# Altium project UL-SWAP-DAQ-2-MAIN.PrjPcb
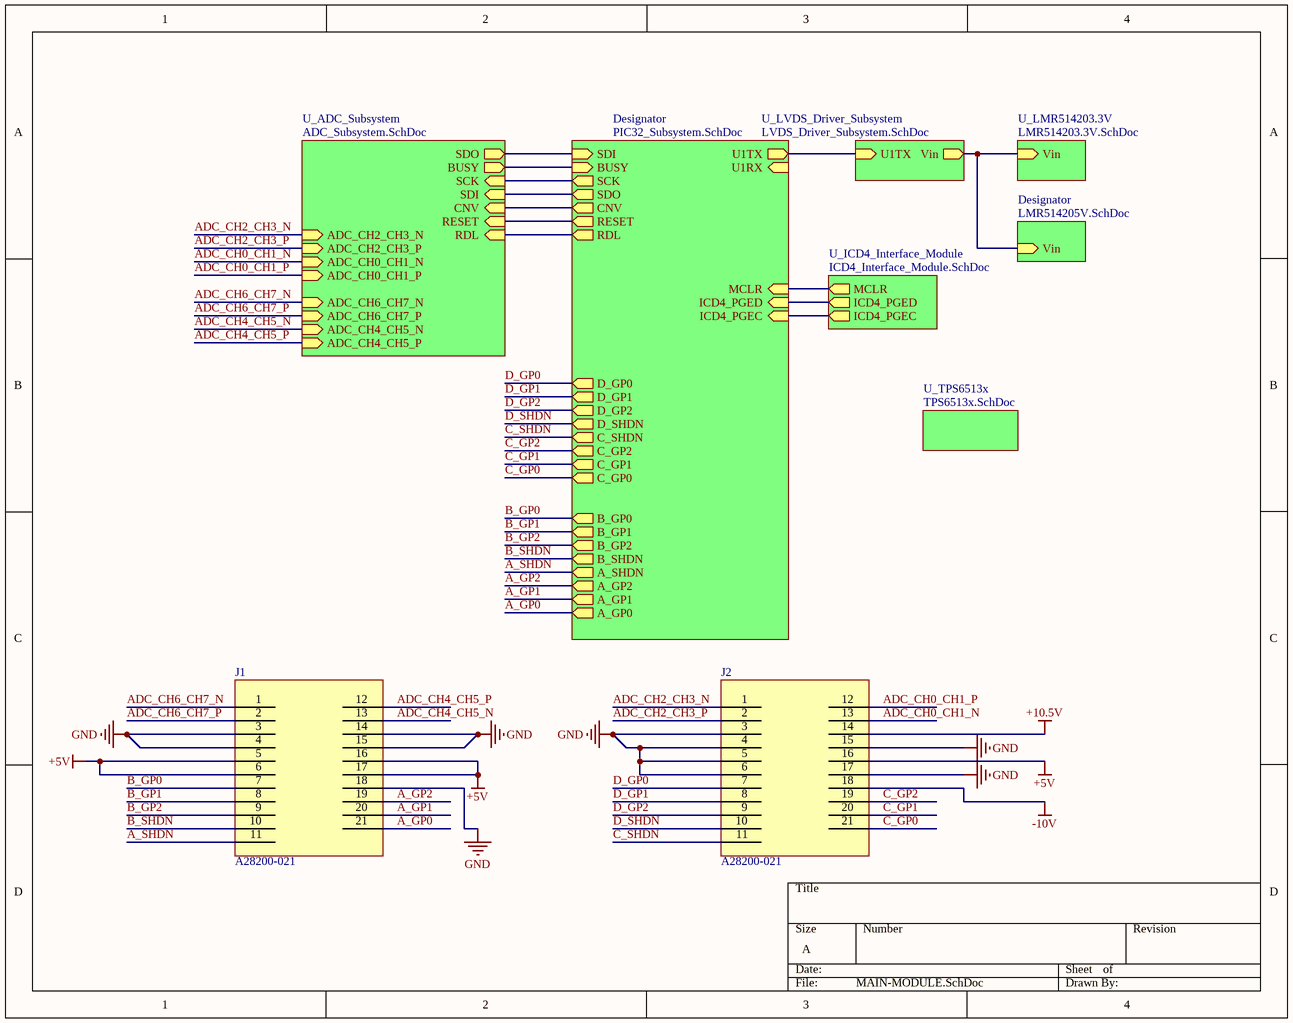
[diagram p0: MAIN-MODULE.SchDoc]
8 sheets, 70 parts. Net scope: hierarchical (ports join the sheet entries above them; power ports are global).
Board file: UL-SWAP-DAQ-3-MAIN.PcbDoc
Sheets:
  MAIN-MODULE.SchDoc
    Designator = PIC32_Subsystem.SchDoc
    U_ADC_Subsystem = ADC_Subsystem.SchDoc
    U_ICD4_Interface_Module = ICD4_Interface_Module.SchDoc
    U_LMR514203.3V = LMR514203.3V.SchDoc
    U_LVDS_Driver_Subsystem = LVDS_Driver_Subsystem.SchDoc
    Designator = LMR514205V.SchDoc
    U_TPS6513x = TPS6513x.SchDoc

## Sheet MAIN-MODULE.SchDoc
size A; SheetNumber: 1; SheetTotal: 8

### Parts
J1  A28200-021  [A28200-021]
J2  A28200-021  [A28200-021]

### Sub-sheets
Designator = PIC32_Subsystem.SchDoc: ICD4_PGED (in), ICD4_PGEC (in), MCLR (in), SCK (out), U1RX (in), SDO (out), RESET (out), SDI (in), U1TX (out), BUSY (in), CNV (out), RDL (out), C_GP1 (out), C_GP2 (out), C_GP0 (out), C_SHDN (out), A_GP2 (out), A_GP0 (out), A_GP1 (out), A_SHDN (out), D_SHDN (out), D_GP0 (out), D_GP1 (out), D_GP2 (out), B_GP0 (out), B_GP1 (out), B_GP2 (out), B_SHDN (out)
Designator = LMR514205V.SchDoc: Vin (in)
U_ADC_Subsystem = ADC_Subsystem.SchDoc: SDO (out), SCK (in), SDI (in), BUSY (out), CNV (in), RESET (in), RDL (in), ADC_CH6_CH7_P (in), ADC_CH6_CH7_N (in), ADC_CH4_CH5_P (in), ADC_CH4_CH5_N (in), ADC_CH2_CH3_N (in), ADC_CH2_CH3_P (in), ADC_CH0_CH1_N (in), ADC_CH0_CH1_P (in)
U_ICD4_Interface_Module = ICD4_Interface_Module.SchDoc: MCLR (out), ICD4_PGED (out), ICD4_PGEC (out)
U_LMR514203.3V = LMR514203.3V.SchDoc: Vin (in)
U_LVDS_Driver_Subsystem = LVDS_Driver_Subsystem.SchDoc: U1TX (in), Vin (out)
U_TPS6513x = TPS6513x.SchDoc: no entries

### Nets
+5V: J1.5 J1.6 J1.16 J1.17 J2.16
+10.5V: J2.14
-10V: J2.18
GND: J1.3 J1.4 J1.14 J1.15 J1.18 J2.3 J2.4 J2.5 J2.6 J2.15 J2.17
A_GP0: J1.21 ; sheet Designator/A_GP0
A_GP1: J1.20 ; sheet Designator/A_GP1
A_GP2: J1.19 ; sheet Designator/A_GP2
A_SHDN: J1.11 ; sheet Designator/A_SHDN
ADC_CH0_CH1_N: J2.13 ; sheet U_ADC_Subsystem/ADC_CH0_CH1_N
ADC_CH0_CH1_P: J2.12 ; sheet U_ADC_Subsystem/ADC_CH0_CH1_P
ADC_CH2_CH3_N: J2.1 ; sheet U_ADC_Subsystem/ADC_CH2_CH3_N
ADC_CH2_CH3_P: J2.2 ; sheet U_ADC_Subsystem/ADC_CH2_CH3_P
ADC_CH4_CH5_N: J1.13 ; sheet U_ADC_Subsystem/ADC_CH4_CH5_N
ADC_CH4_CH5_P: J1.12 ; sheet U_ADC_Subsystem/ADC_CH4_CH5_P
ADC_CH6_CH7_N: J1.1 ; sheet U_ADC_Subsystem/ADC_CH6_CH7_N
ADC_CH6_CH7_P: J1.2 ; sheet U_ADC_Subsystem/ADC_CH6_CH7_P
B_GP0: J1.7 ; sheet Designator/B_GP0
B_GP1: J1.8 ; sheet Designator/B_GP1
B_GP2: J1.9 ; sheet Designator/B_GP2
B_SHDN: J1.10 ; sheet Designator/B_SHDN
BUSY: sheet Designator/BUSY, sheet U_ADC_Subsystem/BUSY
C_GP0: J2.21 ; sheet Designator/C_GP0
C_GP1: J2.20 ; sheet Designator/C_GP1
C_GP2: J2.19 ; sheet Designator/C_GP2
C_SHDN: J2.11 ; sheet Designator/C_SHDN
CNV: sheet Designator/CNV, sheet U_ADC_Subsystem/CNV
D_GP0: J2.7 ; sheet Designator/D_GP0
D_GP1: J2.8 ; sheet Designator/D_GP1
D_GP2: J2.9 ; sheet Designator/D_GP2
D_SHDN: J2.10 ; sheet Designator/D_SHDN
MCLR: sheet Designator/MCLR, sheet U_ICD4_Interface_Module/MCLR
PGC: sheet Designator/ICD4_PGEC, sheet U_ICD4_Interface_Module/ICD4_PGEC
PGD: sheet Designator/ICD4_PGED, sheet U_ICD4_Interface_Module/ICD4_PGED
RDL: sheet Designator/RDL, sheet U_ADC_Subsystem/RDL
RESET: sheet Designator/RESET, sheet U_ADC_Subsystem/RESET
UART_TX: sheet Designator/U1TX, sheet U_LVDS_Driver_Subsystem/U1TX
Vin: sheet U_LMR514203.3V/Vin, sheet U_LVDS_Driver_Subsystem/Vin, sheet Designator/Vin
NetU1_47: sheet Designator/SDI, sheet U_ADC_Subsystem/SDO
NetU1_50: sheet Designator/SCK, sheet U_ADC_Subsystem/SCK
NetU1_51: sheet Designator/SDO, sheet U_ADC_Subsystem/SDI

### Library data of the parts
J1 J2 = A28200-021: CONN NANO-D PLUG 21POS SMD SLDR

## Sheet PIC32_Subsystem.SchDoc
size A; SheetNumber: 6; SheetTotal: 7
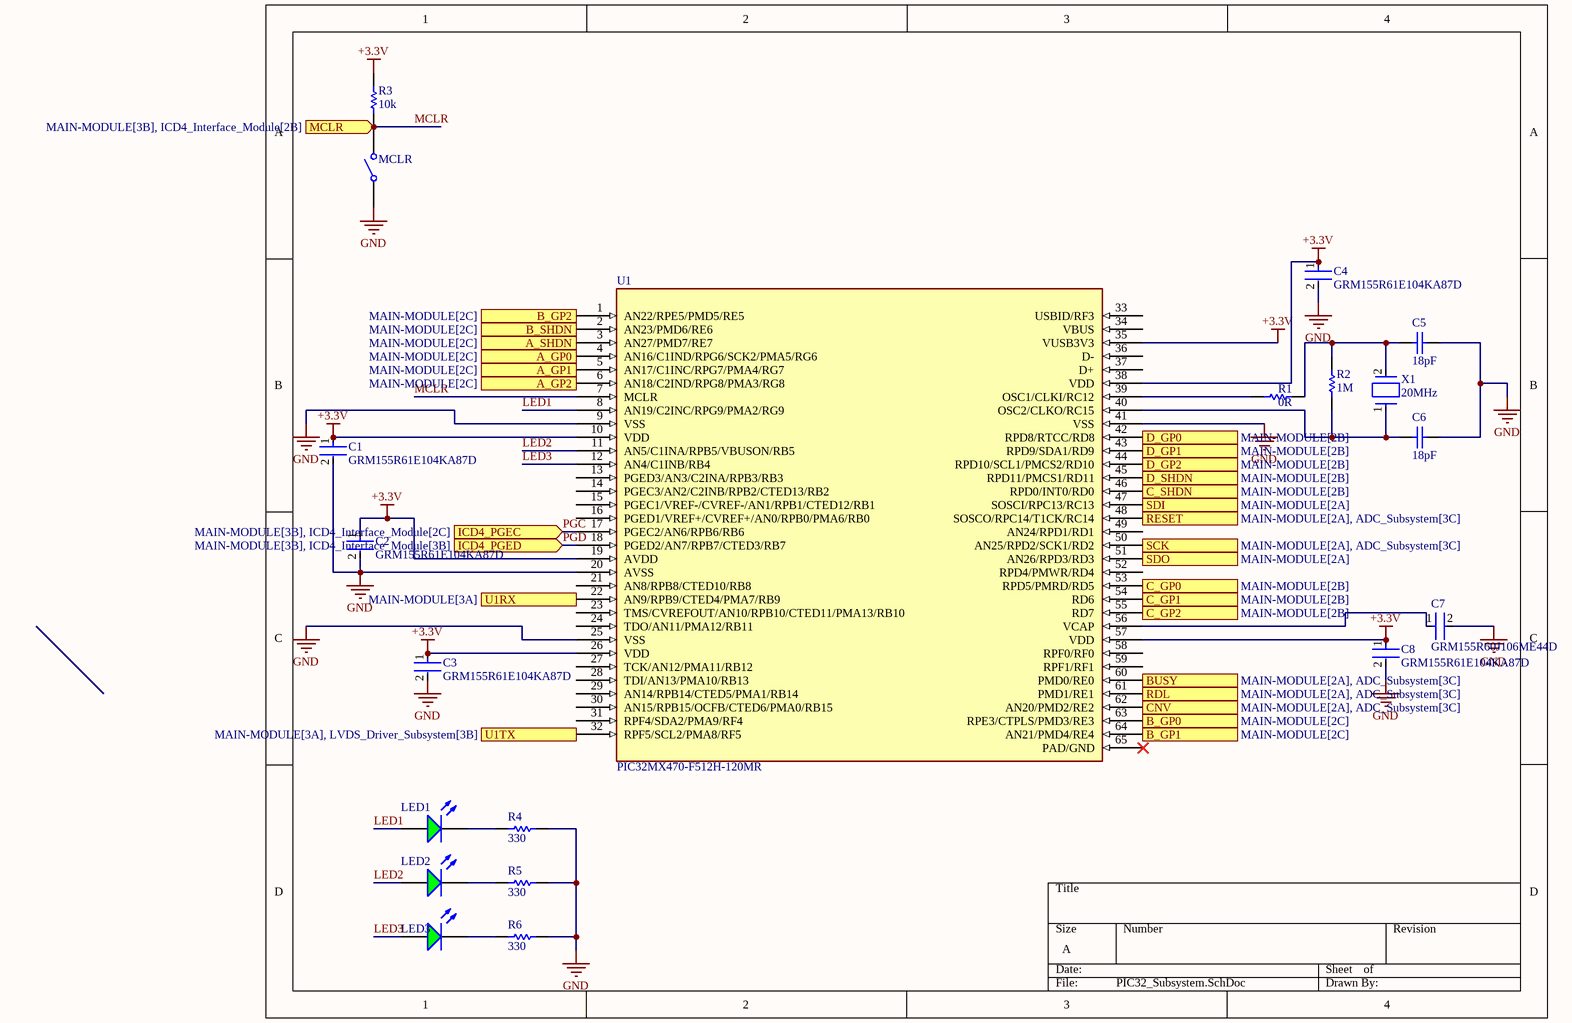
[diagram p1: PIC32_Subsystem.SchDoc]

### Parts
C1  GRM155R61E104KA87D  [FP-GRM155-0_05-IPC_A]
C2  GRM155R61E104KA87D  [FP-GRM155-0_05-IPC_A]
C3  GRM155R61E104KA87D  [FP-GRM155-0_05-IPC_A]
C4  GRM155R61E104KA87D  [FP-GRM155-0_05-IPC_A]
C5  18pF  [CAPC1005X55X25LL05T10]
C6  18pF  [CAPC1005X55X25LL05T10]
C7  GRM155R60J106ME44D  [FP-GRM155-0_2-IPC_A]
C8  GRM155R61E104KA87D  [FP-GRM155-0_05-IPC_A]
LED1  (no value)  [KING-APT1608SGC_V]
LED2  (no value)  [KING-APT1608SGC_V]
LED3  (no value)  [KING-APT1608SGC_V]
MCLR  434121043816  [434121043816]  (value not drawn)
R1  0R  [RESC1005X40X25LL05T10]
R2  1M  [RESC1005X40X25LL05T05]
R3  10k  [RESC1005X40X25LL05T05]
R4  330  [RESC1609X50X30LL10T20]
R5  330  [RESC1609X50X30LL10T20]
R6  330  [RESC1609X50X30LL10T20]
U1  PIC32MX470-F512H-120MR  [TQFP]
X1  20MHz  [FP-ABM7-MFG]

### Ports
A_GP0 (out, see MAIN-MODULE[2C]), A_GP1 (out, see MAIN-MODULE[2C]), A_GP2 (out, see MAIN-MODULE[2C]), A_SHDN (out, see MAIN-MODULE[2C]), B_GP0 (out, see MAIN-MODULE[2C]), B_GP1 (out, see MAIN-MODULE[2C]), B_GP2 (out, see MAIN-MODULE[2C]), B_SHDN (out, see MAIN-MODULE[2C]), BUSY (in, see MAIN-MODULE[2A], ADC_Subsystem[3C]), C_GP0 (out, see MAIN-MODULE[2B]), C_GP1 (out, see MAIN-MODULE[2B]), C_GP2 (out, see MAIN-MODULE[2B]), C_SHDN (out, see MAIN-MODULE[2B]), CNV (out, see MAIN-MODULE[2A], ADC_Subsystem[3C]), D_GP0 (out, see MAIN-MODULE[2B]), D_GP1 (out, see MAIN-MODULE[2B]), D_GP2 (out, see MAIN-MODULE[2B]), D_SHDN (out, see MAIN-MODULE[2B]), ICD4_PGEC (in, see MAIN-MODULE[3B], ICD4_Interface_Module[2C]), ICD4_PGED (in, see MAIN-MODULE[3B], ICD4_Interface_Module[3B]), MCLR (in, see MAIN-MODULE[3B], ICD4_Interface_Module[2B]), RDL (out, see MAIN-MODULE[2A], ADC_Subsystem[3C]), RESET (out, see MAIN-MODULE[2A], ADC_Subsystem[3C]), SCK (out, see MAIN-MODULE[2A], ADC_Subsystem[3C]), SDI (in, see MAIN-MODULE[2A]), SDO (out, see MAIN-MODULE[2A]), U1RX (in, see MAIN-MODULE[3A]), U1TX (out, see MAIN-MODULE[3A], LVDS_Driver_Subsystem[3B])

### Nets
+3.3V: C1.1 C2.1 C3.1 C4.1 C8.1 R3.2 U1.10(VDD) U1.19(AVDD) U1.26(VDD) U1.35(VUSB3V3) U1.38(VDD) U1.57(VDD)
GND: C1.2 C2.2 C3.2 C4.2 C5.2 C6.2 C7.2 C8.2 MCLR.1 R4.2 R5.2 R6.2 U1.9(VSS) U1.20(AVSS) U1.25(VSS) U1.41(VSS)
A_GP0: U1.4(AN16/C1IND/RPG6/SCK2/PMA5/RG6) ; port A_GP0
A_GP1: U1.5(AN17/C1INC/RPG7/PMA4/RG7) ; port A_GP1
A_GP2: U1.6(AN18/C2IND/RPG8/PMA3/RG8) ; port A_GP2
A_SHDN: U1.3(AN27/PMD7/RE7) ; port A_SHDN
B_GP0: U1.63(RPE3/CTPLS/PMD3/RE3) ; port B_GP0
B_GP1: U1.64(AN21/PMD4/RE4) ; port B_GP1
B_GP2: U1.1(AN22/RPE5/PMD5/RE5) ; port B_GP2
B_SHDN: U1.2(AN23/PMD6/RE6) ; port B_SHDN
BUSY: U1.60(PMD0/RE0) ; port BUSY
C_GP0: U1.53(RPD5/PMRD/RD5) ; port C_GP0
C_GP1: U1.54(RD6) ; port C_GP1
C_GP2: U1.55(RD7) ; port C_GP2
C_SHDN: U1.46(RPD0/INT0/RD0) ; port C_SHDN
CNV: U1.62(AN20/PMD2/RE2) ; port CNV
D_GP0: U1.42(RPD8/RTCC/RD8) ; port D_GP0
D_GP1: U1.43(RPD9/SDA1/RD9) ; port D_GP1
D_GP2: U1.44(RPD10/SCL1/PMCS2/RD10) ; port D_GP2
D_SHDN: U1.45(RPD11/PMCS1/RD11) ; port D_SHDN
LED1: LED1.1(A) U1.8(AN19/C2INC/RPG9/PMA2/RG9)
LED2: LED2.1(A) U1.11(AN5/C1INA/RPB5/VBUSON/RB5)
LED3: LED3.1(A) U1.12(AN4/C1INB/RB4)
MCLR: MCLR.2 R3.1 U1.7(MCLR) ; port MCLR
PGC: U1.17(PGEC2/AN6/RPB6/RB6) ; port ICD4_PGEC
PGD: U1.18(PGED2/AN7/RPB7/CTED3/RB7) ; port ICD4_PGED
RDL: U1.61(PMD1/RE1) ; port RDL
RESET: U1.48(SOSCO/RPC14/T1CK/RC14) ; port RESET
UART_TX: U1.32(RPF5/SCL2/PMA8/RF5) ; port U1TX
NetC5_1: C5.1 R1.2 R2.2 X1.2
NetC6_1: C6.1 R2.1 U1.40(OSC2/CLKO/RC15) X1.1
NetC7_1: C7.1 U1.56(VCAP)
NetLED1_2: LED1.2(K) R4.1
NetLED2_2: LED2.2(K) R5.1
NetLED3_2: LED3.2(K) R6.1
NetR1_1: R1.1 U1.39(OSC1/CLKI/RC12)
NetU1_22: U1.22(AN9/RPB9/CTED4/PMA7/RB9) ; port U1RX
NetU1_47: U1.47(SOSCI/RPC13/RC13) ; port SDI
NetU1_50: U1.50(AN25/RPD2/SCK1/RD2) ; port SCK
NetU1_51: U1.51(AN26/RPD3/RD3) ; port SDO

Not connected (* = marked no-connect by the designer): U1 13(PGED3/AN3/C2INA/RPB3/RB3) 14(PGEC3/AN2/C2INB/RPB2/CTED13/RB2) 15(PGEC1/VREF-/CVREF-/AN1/RPB1/CTED12/RB1) 16(PGED1/VREF+/CVREF+/AN0/RPB0/PMA6/RB0) 21(AN8/RPB8/CTED10/RB8) 23(TMS/CVREFOUT/AN10/RPB10/CTED11/PMA13/RB10) 24(TDO/AN11/PMA12/RB11) 27(TCK/AN12/PMA11/RB12) 28(TDI/AN13/PMA10/RB13) 29(AN14/RPB14/CTED5/PMA1/RB14) 30(AN15/RPB15/OCFB/CTED6/PMA0/RB15) 31(RPF4/SDA2/PMA9/RF4) 33(USBID/RF3) 34(VBUS) 36(D-) 37(D+) 49(AN24/RPD1/RD1) 52(RPD4/PMWR/RD4) 58(RPF0/RF0) 59(RPF1/RF1) 65(PAD/GND)*

### Library data of the parts
C1-C4 C8 = CMP-2008-04580-2: CAP CER 0.1UF 25V X5R 0402; Lead/Base Style: Bayonet; Capacitance: 100nF; Tolerance: 10%; Material: Ceramic; REACH SVHC: No SVHC; Voltage: 25V; Voltage Rating: 25V; Length: 1mm; Min Operating Temperature: -55°C; Case/Package: 0402; Width: 0.5mm; Termination: Standard; Series: GRM; Mount: Surface Mount; Thickness: 0.022inch; Lead Free: Lead Free; Voltage Rating (DC): 25V; Package Quantity: 10000; Weight: 0.000388oz; Height: 0.5mm; Case Code (Metric): 1005; RoHS Compliant: Yes; Packaging: Cut Tape; Depth: 0.5mm; Case Code (Imperial): 0402; Radiation Hardening: No; Max Operating Temperature: 85°C; Dielectric: X5R
C5 C6 = CMP-2008-04271-1: GRM1555C1H180GA01D; Manufacturer: Murata; Part Number: GRM1555C1H180GA01D
C7 = CMP-2000-05265-2: CAP CER 10UF 6.3V X5R 0402; Tolerance: 20%; Voltage Rating: 6.3V; Voltage Rating (DC): 6.3V; Voltage: 6.3V; Case Code (Metric): 1005; REACH SVHC: No SVHC; Min Operating Temperature: -55°C; Height: 0.5mm; Dielectric: X5R; Depth: 0.5mm; Thickness: 0.022inch; Packaging: Tape and Reel; Length: 1mm; Mount: Surface Mount; Package Quantity: 10000; Lead Free: Lead Free; Case/Package: 0402; Termination: SMD/SMT; Max Operating Temperature: 85°C; Case Code (Imperial): 0402; Series: GRM; Capacitance: 10uF; Width: 0.5mm; RoHS Compliant: Yes
LED1-LED3 = CMP-2000-05789-1: Super Bright Green LED, 62.5 mW, 25 mA, -40 to 85 degC, 2-Pin SMD, RoHS, Tape and Reel, APT1608SGC; Manufacturer: Kingbright; Online Catalog: 0603RectanglewithFlatTopChipLEDs; Wavelength - Dominant: 568nm; Wavelength - Peak: 565nm; Voltage - Forward (Vf) (Typ): 2.2V; Lens Type: Clear; Other Names: 754-1121-2; Millicandela Rating: 15mcd; Catalog Drawings: APT1608SeriesTop / APT1608SeriesSide; Lens Style/Size: RectanglewithFlatTop,1.2mmx0.8mm; Current - Test: 20mA; 3D Model: APT1608x.sldprt / APT1608x.pro / APT1608x.igs / APT1608x.stp; Viewing Angle: 120°; Package / Case: 0603(1608Metric); Category: Optoelectronics; Package Description: 2-Pin Surface Mount Device, Body 0.8 x 1.6 mm; Mounting Type: SurfaceMount; Color: Green; Height: 0.75mm; Datasheet Version: Rev. 16B, 02/2012; Family: LEDIndication-Discrete; Manufacturer URL: http://www.kingbright.com/; Package Reference: APT1608SGC; Datasheet URL: https://datasheet.ciiva.com/2113/apt1608sgc-2113808.pdf; Mounting Technology: SurfaceMount; Packaging: Tape&Reel(TR); Standard Package: 2,000; Size / Dimension: 1.60mmLx0.80mmW
MCLR = CMP-1459-00005-1: WS-TASV SMD Tact Switch 6.0X3.5 mm; Manufacturer: Wuerth Elektronik; NoPins: 02; ComponentLink1URL: http://www.we-online.com; PartNumber: 434121043816; ComponentLink2URL: http://katalog.we-online.de/em/datasheet/434121043816.pdf; ComponentLink2Description: Datasheet; ComponentLink1Description: Manufacturer URL; PackageReference: 434121043816
R1 = CMP-1011-00001-2: RC0402JR-070RL; Manufacturer: Yageo / Phycomp; Part Number: RC0402JR-070RL
R2 = CMP-2002-00609-3: Chip Resistor, 1 MOhm, +/- 1%, 100 mW, -55 to 155 degC, 0402 (1005 Metric), RoHS, Tape and Reel / ERJ-2RKF1004X; Manufacturer: Basic Passives; Voltage Rating: 50 V; Case\/Package: 0402; Resistance: 1 MOhm; Power Rating: 100 mW; Pins: 2; Max Operating Temperature: 155 degC; ComponentLink2URL: http://industrial.panasonic.com/cdbs/www-data/pdf/RDA0000/AOA0000C86.pdf; Weight: 2.8E-05oz; ComponentLink1URL: http://www.panasonic.com/; Radiation Hardening: No; Height: 0.35 mm; Case Code (Imperial): 0402; ComponentLink2Description: Datasheet; Mount: Surface Mount; ComponentLink1Description: Manufacturer URL; REACH SVHC: Yes; PartNumber: ERJ-2RKF1004X; Length: 1 mm; Min Operating Temperature: -55 degC; Width: 0.5 mm; Package Quantity: 10000; Tolerance: 1%; PackageDescription: 2-Pin Surface Mount Device, Body 1 x 0.5 mm; RoHSCompliant: true; DatasheetVersion: 04/2015; PackageReference: 0402; Mounting Technology: Surface Mount; Case Code (Metric): 1005; Packaging: Tape and Reel
R3 = CMP-2000-07588-1: Chip Resistor, 10 KOhm, +/- 1%, 0.1 W, -55 to 155 degC, 0402 (1005 Metric), RoHS, Tape and Reel / ERJ2RKF1002X; Manufacturer: Panasonic; Power Rating: 100mW; Voltage Rating: 50V; Resistance: 10KOhm; Case\/Package: 0402; Temperature Coefficient: 100ppm\/degreesC; RoHSCompliant: True; Lead Free: LeadFree; Package Quantity: 1; Contact Plating: Tin; Length: 1mm; Radiation Hardening: No; REACH SVHC: NoSVHC; Max Operating Temperature: 155degC; Depth: 0.5mm; Case Code (Imperial): 0402; Military Standard: Not; Package Description: 2-Pin Surface Mount Device, Body 1 x 0.5 mm; Termination: SMD/SMT; Case Code (Metric): 1005; Height: 0.35mm; Packaging: TapeandReel; Voltage Rating (DC): 50V; Package Reference: 402; Number of Pins: 2; Tolerance: 1%; Mounting Technology: SurfaceMount; Width: 0.02inch; Mount: SurfaceMount; Datasheet URL: https://industrial.panasonic.com/cdbs/www-data/pdf/RDA0000/AOA0000C304.pdf; Composition: ThickFilm; Datasheet Version: 02/2017; Manufacturer URL: http://www.panasonic.com/; Max Power Dissipation: 100mW; Number of Terminations: 2; Min Operating Temperature: -55degC
R4-R6 = CMP-1012-00062-2: CRCW0603330RJNEA; Manufacturer: Vishay Dale; Part Number: CRCW0603330RJNEA
X1 = CMP-27762-013587-1: Crystal 20MHz ±20ppm 18pF SMD-2 6mm x 3.5mm / ABM7-20.000MHZ-D2Y-T; Frequency Stability: 30ppm; ESR (Equivalent Series Resistance): 50R; Contact Plating: Gold; Load Capacitance: 18pF; Tolerance: 20ppm; Length: 6mm; Frequency: 20MHz; Lead Free: Lead Free; Package Quantity: 1000; Resistor Type: Ceramic; Min Operating Temperature: -40°C; Max Operating Temperature: 85°C; Series: ABM7; Depth: 3.5mm; Width: 0.138inch; Frequency Tolerance: 20ppm; Termination: SMD/SMT; Radiation Hardening: No; Case/Package: CSMD; Height: 0.055inch; Packaging: Tape and Reel; Operating Frequency: 20 MHz; Series Resistance: 50R; Number of Pins: 2; Mount: Surface Mount

## Sheet ADC_Subsystem.SchDoc
size A; SheetNumber: 2; SheetTotal: 7
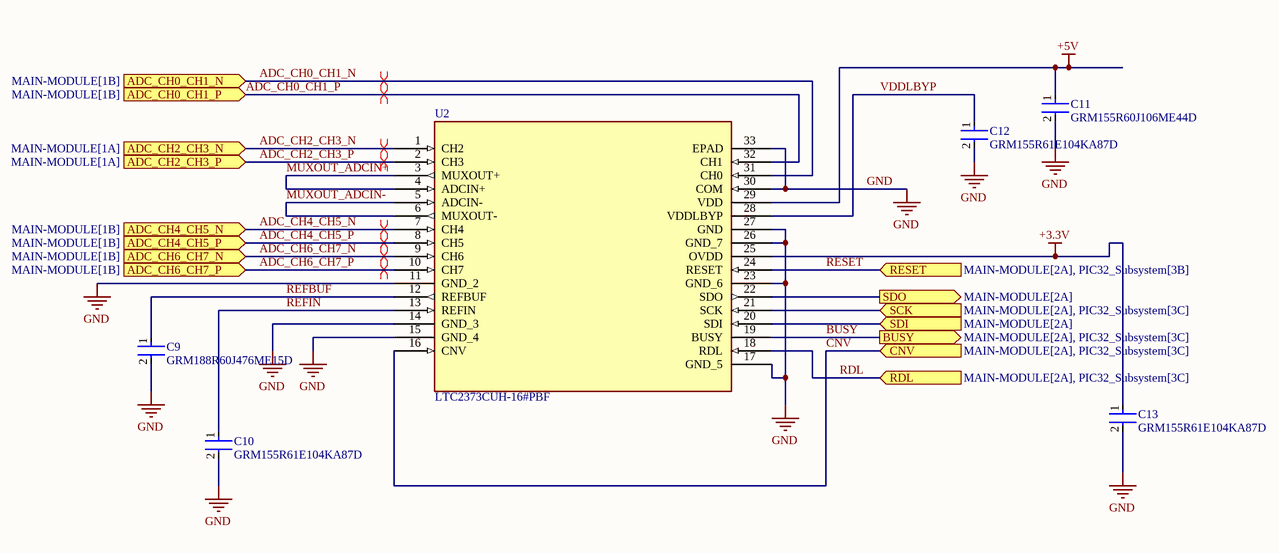
[diagram p2: ADC_Subsystem.SchDoc]

### Parts
C9  GRM188R60J476ME15D  [FP-GRM188-0_2-IPC_B]
C10  GRM155R61E104KA87D  [FP-GRM155-0_05-IPC_A]
C11  GRM155R60J106ME44D  [FP-GRM155-0_2-IPC_A]
C12  GRM155R61E104KA87D  [FP-GRM155-0_05-IPC_A]
C13  GRM155R61E104KA87D  [FP-GRM155-0_05-IPC_A]
U2  LTC2373CUH-16#PBF  [LTC_2373_Footprint]

### Ports
ADC_CH0_CH1_N (in, see MAIN-MODULE[1B]), ADC_CH0_CH1_P (in, see MAIN-MODULE[1B]), ADC_CH2_CH3_N (in, see MAIN-MODULE[1A]), ADC_CH2_CH3_P (in, see MAIN-MODULE[1A]), ADC_CH4_CH5_N (in, see MAIN-MODULE[1B]), ADC_CH4_CH5_P (in, see MAIN-MODULE[1B]), ADC_CH6_CH7_N (in, see MAIN-MODULE[1B]), ADC_CH6_CH7_P (in, see MAIN-MODULE[1B]), BUSY (out, see MAIN-MODULE[2A], PIC32_Subsystem[3C]), CNV (in, see MAIN-MODULE[2A], PIC32_Subsystem[3C]), RDL (in, see MAIN-MODULE[2A], PIC32_Subsystem[3C]), RESET (in, see MAIN-MODULE[2A], PIC32_Subsystem[3B]), SCK (in, see MAIN-MODULE[2A], PIC32_Subsystem[3C]), SDI (in, see MAIN-MODULE[2A]), SDO (out, see MAIN-MODULE[2A])

### Nets
+3.3V: C13.1 U2.25(OVDD)
+5V: C11.1 U2.29(VDD)
GND: C9.2 C10.2 C11.2 C12.2 C13.2 U2.11(GND_2) U2.14(GND_3) U2.15(GND_4) U2.17(GND_5) U2.23(GND_6) U2.26(GND_7) U2.27(GND) U2.30(COM) U2.33(EPAD)
ADC_CH0_CH1_N: U2.31(CH0) ; port ADC_CH0_CH1_N
ADC_CH0_CH1_P: U2.32(CH1) ; port ADC_CH0_CH1_P
ADC_CH2_CH3_N: U2.1(CH2) ; port ADC_CH2_CH3_N
ADC_CH2_CH3_P: U2.2(CH3) ; port ADC_CH2_CH3_P
ADC_CH4_CH5_N: U2.7(CH4) ; port ADC_CH4_CH5_N
ADC_CH4_CH5_P: U2.8(CH5) ; port ADC_CH4_CH5_P
ADC_CH6_CH7_N: U2.9(CH6) ; port ADC_CH6_CH7_N
ADC_CH6_CH7_P: U2.10(CH7) ; port ADC_CH6_CH7_P
BUSY: U2.19(BUSY) ; port BUSY
CNV: U2.16(CNV) ; port CNV
MUXOUT_ADCIN+: U2.3(MUXOUT+) U2.4(ADCIN+)
MUXOUT_ADCIN-: U2.5(ADCIN-) U2.6(MUXOUT-)
RDL: U2.18(RDL) ; port RDL
REFBUF: C9.1 U2.12(REFBUF)
REFIN: C10.1 U2.13(REFIN)
RESET: U2.24(RESET) ; port RESET
VDDLBYP: C12.1 U2.28(VDDLBYP)
NetU1_47: U2.22(SDO) ; port SDO
NetU1_50: U2.21(SCK) ; port SCK
NetU1_51: U2.20(SDI) ; port SDI

### Layout directives
differential pair: ADC_CH0_CH1_N, ADC_CH0_CH1_P, ADC_CH2_CH3_N, ADC_CH2_CH3_P, ADC_CH4_CH5_N, ADC_CH4_CH5_P, ADC_CH6_CH7_N, ADC_CH6_CH7_P

### Library data of the parts
C9 = CMP-2000-05444-2: Chip Multilayer Ceramic Capacitors for General Purpose, 0603, 47uF, X5R, 15%, 20%, 6.3V; Voltage Rating (DC): 6.3V; Thickness: 0.039inch; Case Code (Imperial): 0603; Packaging: Tape and Reel; Capacitance: 47uF; Width: 0.031inch; Dielectric: X5R; Max Operating Temperature: 85°C; Mount: Surface Mount; Case Code (Metric): 1608; Length: 0.063inch; Voltage Rating: 6.3V; Tolerance: 20%; Case/Package: 0603; Min Operating Temperature: -55°C
C10 C12 C13 = CMP-2008-04580-2: as C1 on sheet PIC32_Subsystem; REACH SVHC: No SVHC; Voltage: 25V; Voltage Rating: 25V; Length: 1mm; Min Operating Temperature: -55°C; Case/Package: 0402; Width: 0.5mm; Termination: Standard; Series: GRM; Mount: Surface Mount; Thickness: 0.022inch; Lead Free: Lead Free; Voltage Rating (DC): 25V; Package Quantity: 10000; Weight: 0.000388oz; Height: 0.5mm; Case Code (Metric): 1005; RoHS Compliant: Yes; Packaging: Cut Tape; Depth: 0.5mm; Case Code (Imperial): 0402; Radiation Hardening: No; Max Operating Temperature: 85°C; Dielectric: X5R
C11 = CMP-2000-05265-2: as C7 on sheet PIC32_Subsystem; Voltage Rating: 6.3V; Voltage Rating (DC): 6.3V; Voltage: 6.3V; Case Code (Metric): 1005; REACH SVHC: No SVHC; Min Operating Temperature: -55°C; Height: 0.5mm; Dielectric: X5R; Depth: 0.5mm; Thickness: 0.022inch; Packaging: Tape and Reel; Length: 1mm; Mount: Surface Mount; Package Quantity: 10000; Lead Free: Lead Free; Case/Package: 0402; Termination: SMD/SMT; Max Operating Temperature: 85°C; Case Code (Imperial): 0402; Series: GRM; Capacitance: 10uF; Width: 0.5mm; RoHS Compliant: Yes

## Sheet ICD4_Interface_Module.SchDoc
size A; SheetNumber: 3; SheetTotal: 7
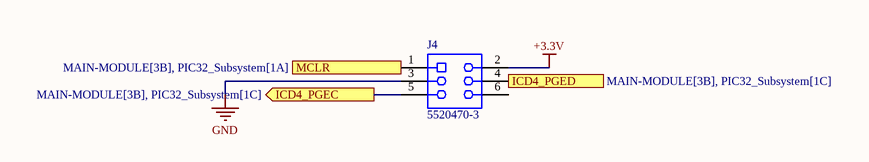
[diagram p3: ICD4_Interface_Module.SchDoc]

### Parts
J4  5520470-3  [TECO-5520470-3_V]

### Ports
ICD4_PGEC (out, see MAIN-MODULE[3B], PIC32_Subsystem[1C]), ICD4_PGED (out, see MAIN-MODULE[3B], PIC32_Subsystem[1C]), MCLR (out, see MAIN-MODULE[3B], PIC32_Subsystem[1A])

### Nets
+3.3V: J4.2
GND: J4.3
MCLR: J4.1 ; port MCLR
PGC: J4.5 ; port ICD4_PGEC
PGD: J4.4 ; port ICD4_PGED

Not connected (* = marked no-connect by the designer): J4 6

### Library data of the parts
J4 = CMP-1682-00001-5: Modular Jack, 6 Position, Right Angle, RoHS, Tray; Manufacturer: TE Connectivity; Voltage Rating: 150 V; Current Rating: 1.5 A; Lead Pitch: 2.54 mm; Contact Material: Bronze; RoHSCompliant: true; Contact Finish: Gold; REACH SVHC: Unknown; Height: 16.13 mm; Colour: Black; ComponentLink1Description: Manufacturer URL; PackageDescription: Female Header, Pitch 1.27 mm, 2 x 3 Position, Height 16.13 mm, Tail Length 4.32 mm; ComponentLink2URL: http://www.te.com/commerce/DocumentDelivery/DDEController?Action=srchrtrv&DocNm=5520470&DocType=Customer+Drawing&DocLang=English; ComponentLink2Description: Datasheet; Package Quantity: 176; Pins: 6; Length: 13.34 mm; Packaging: Tray; Contact Plating: Gold; Housing Material: PBT; Max Voltage Rating (AC): 150 V; ComponentLink1URL: http://www.te.com/; Mount: Through Hole; DatasheetVersion: Rev. B1, 03/2011; PackageReference: 5520470-3; Mounting Technology: Through Hole

## Sheet LMR514203.3V.SchDoc
size A; SheetNumber: 4; SheetTotal: 8
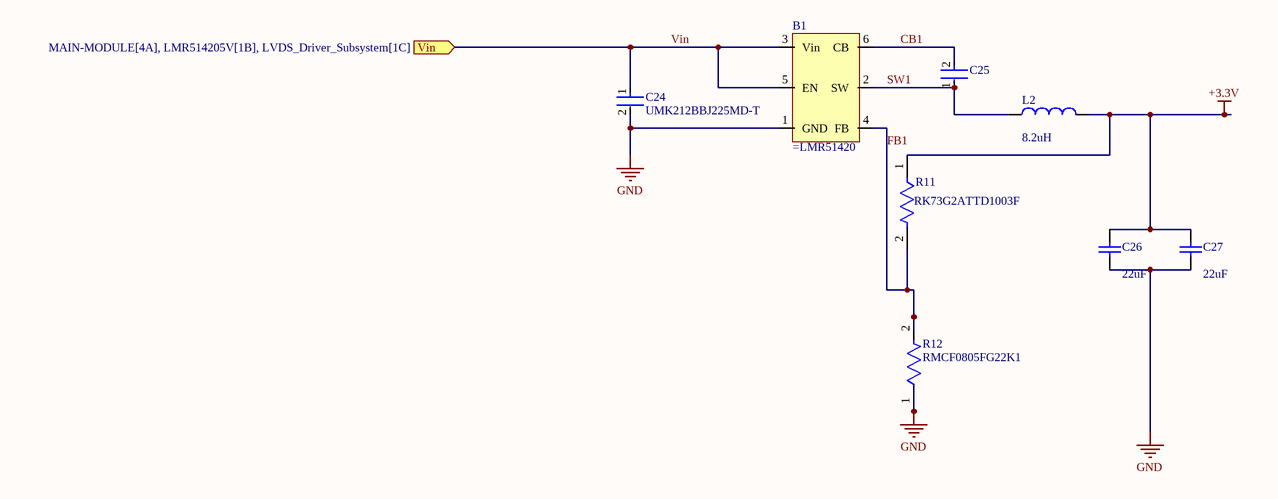
[diagram p4: LMR514203.3V.SchDoc]

### Parts
B1  (no value)  [LMR51420IC]
C24  UMK212BBJ225MD-T  [FP-0805-L_2_0_0_2-W_1_25-IPC_A]
C25  C0603C104K4PAC7867  [CAP CER 0.1UF 16V X7R 0603]  (value not drawn)
C26  value 22uF  [Cap22uF_C1206C226M4PAC7800]  (hidden comment: Comment)
C27  value 22uF  [Cap22uF_C1206C226M4PAC7800]  (hidden comment: Comment)
L2  value 8.2uH  [MSS1246H-103MED 10uH]  (hidden comment: MSS1260H-822MED)
R11  RK73G2ATTD1003F  [FP-RK73G2A-IPC_A]
R12  RMCF0805FG22K1  [FP-RMCF0805-IPC_B]

### Ports
Vin (in, see MAIN-MODULE[4A], LMR514205V[1B], LVDS_Driver_Subsystem[1C])

### Nets
+3.3V: C26.2 C27.2 L2.2 R11.1
GND: B1.1(GND) C24.2 C26.1 C27.1 R12.1
CB1: B1.6(CB) C25.2
FB1: B1.4(FB) R11.2 R12.2
SW1: B1.2(SW) C25.1 L2.1
Vin: B1.3(Vin) B1.5(EN) C24.1 ; port Vin

### Library data of the parts
B1 = Component_1
C24 = CMP-14477-004278-2: Multilayer Ceramic Capacitor 2.2uF 50V X5R 20% SMD 0803 T/R; Max Operating Temperature: 85°C; Tolerance: 20%; Case Code (Imperial): 0805; Case/Package: 0805; Case Code (Metric): 2012; Capacitance: 2.2uF; Min Operating Temperature: -55°C; Mount: Surface Mount; Voltage Rating: 50V; Packaging: Tape and Reel; RoHS Compliant: Yes
C25 = b4654b650e69147ec39a6b967a45e02: CAP CER 0.1UF 16V X5R 0603; Manufacturer: KEMET; Automotive Grade: Grade 1; Value: 0.10 μF; Material: Ceramic; Temperature Coefficient: 30ppm/°C; Tolerance: 0.1; Manufacturer Part Number: C0603C104K4PAC7867; Automotive: Yes; Octopart: https://octopart.com/c0603c104k4pactu-kemet-12592163; Device Class L2: Capacitors; ComponentLink2URL: https://api.kemet.com/component-edge/download/datasheet/C0603C100J5GACAUTO.pdf; RoHS: TRUE; Height: 0.87mm; Temperature Characteristic: X5R; Voltage Rating: 16 V; Device Class L1: Passive Components; Category: Cap; Digikey Description: CAP CER 0.1UF 16V X5R 0603; Temperature Range High: +125°C; Package: C0603C-CF; Device Class L3: Ceramic Capacitors; Lead Free: Yes; Temperature: -55°C to +125°C; Temperature Range Low: -55°C; Capacitance: 0.10 μF; ComponentLink2Description: Datasheet
C26 C27 = Cap: Capacitor; Published: 8-Jun-2000; LatestRevisionDate: 17-Jul-2002; LatestRevisionNote: Re-released for DXP Platform.; PackageReference: RAD-0.3; Publisher: Altium Limited; PackageDescription: Radial Cap, Thru-Hole; 2 Leads; 0.3 in Pin Spacing
L2 = Inductor: Code_IEC: 1005; Published: 8-Jun-2000; LatestRevisionDate: 29-May-2009; LatestRevisionNote: IPC-7351 Footprint Added.; PackageReference: 0402-A; Publisher: Altium Limited; PackageDescription: Chip Inductor; Code_JEITA: 0402
R11 = CMP-04015-080178-1: 100kΩ ±1% 0.125W Chip Resistor 0805 Thick Film AEC-Q200 Qualified; Voltage Rating: 150V; Power Rating: 125mW; Temperature Coefficient: 50ppm/°C; Resistance: 100kR; Series: RK73G; Termination: SMD/SMT; Packaging: Tape and Reel; Tolerance: 1%; Case Code (Imperial): 0805; RoHS Compliant: Yes; Max Operating Temperature: 125°C; Min Operating Temperature: -55°C; Case Code (Metric): 2012
R12 = CMP-26527-006791-1: 22.1kΩ ±1% 0.125W 0805 Thick Film Chip Resistor AEC-Q200 compliant; Max Power Dissipation: 125mW; Temperature Coefficient: 100ppm/°C; Resistance: 22.1kR; Max Operating Temperature: 155°C; Length: 0.079inch; Series: RMCF; RoHS Compliant: Yes; Number of Terminations: 2; Contact Plating: Tin; Width: 0.049inch; Package Quantity: 10000; Radiation Hardening: No; Height: 0.026inch; Features: Automotive AEC-Q200; Lead Free: Lead Free; Case Code (Imperial): 0805; Packaging: Tape and Reel; Mount: Surface Mount; Case/Package: 0805; Resistor Type: Thick Film; Case Code (Metric): 2012; Min Operating Temperature: -55°C; Tolerance: 1%

## Sheet LVDS_Driver_Subsystem.SchDoc
size A; SheetNumber: 5; SheetTotal: 7
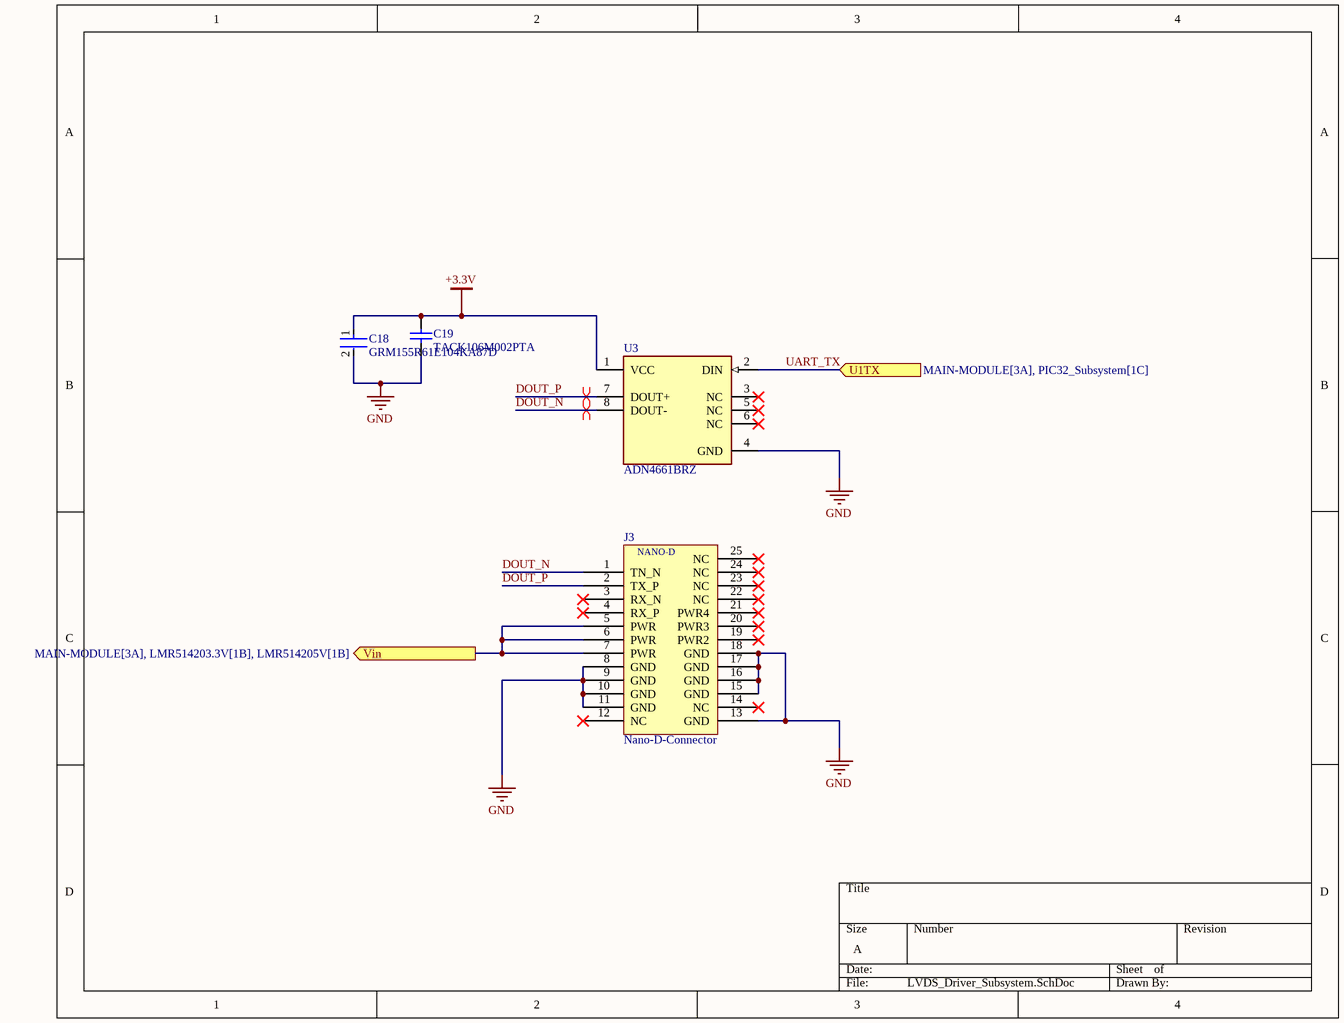
[diagram p5: LVDS_Driver_Subsystem.SchDoc]

### Parts
C18  GRM155R61E104KA87D  [FP-GRM155-0_05-MFG]
C19  TACK106M002PTA  [CAPC1005X70X10NL20T00]
J3  Nano-D-Connector  [A28400-025]
U3  ADN4661BRZ  [FP-R-8-IPC_A]

### Ports
U1TX (in, see MAIN-MODULE[3A], PIC32_Subsystem[1C]), Vin (out, see MAIN-MODULE[3A], LMR514203.3V[1B], LMR514205V[1B])

### Nets
+3.3V: C18.1 C19.2 U3.1(VCC)
GND: C18.2 C19.1 J3.8(GND) J3.9(GND) J3.10(GND) J3.11(GND) J3.13(GND) J3.15(GND) J3.16(GND) J3.17(GND) J3.18(GND) U3.4(GND)
DOUT_N: J3.1(TN_N) U3.8(DOUT-)
DOUT_P: J3.2(TX_P) U3.7(DOUT+)
UART_TX: U3.2(DIN) ; port U1TX
Vin: J3.5(PWR) J3.6(PWR) J3.7(PWR) ; port Vin

Not connected (* = marked no-connect by the designer): J3 3(RX_N)* 4(RX_P)* 12(NC)* 14(NC)* 19(PWR2)* 20(PWR3)* 21(PWR4)* 22(NC)* 23(NC)* 24(NC)* 25(NC)*; U3 3(NC)* 5(NC)* 6(NC)*

### Layout directives
differential pair: DOUT_N, DOUT_P

### Notes on the sheet
- (in symbol Nano-D-Connector) NANO-D

### Library data of the parts
C18 = CMP-2008-04580-2: as C1 on sheet PIC32_Subsystem; REACH SVHC: No SVHC; Voltage: 25V; Voltage Rating: 25V; Length: 1mm; Min Operating Temperature: -55°C; Case/Package: 0402; Width: 0.5mm; Termination: Standard; Series: GRM; Mount: Surface Mount; Thickness: 0.022inch; Lead Free: Lead Free; Voltage Rating (DC): 25V; Package Quantity: 10000; Weight: 0.000388oz; Height: 0.5mm; Case Code (Metric): 1005; RoHS Compliant: Yes; Packaging: Cut Tape; Depth: 0.5mm; Case Code (Imperial): 0402; Radiation Hardening: No; Max Operating Temperature: 85°C; Dielectric: X5R
C19 = CMP-2008-00067-1: Manufacturer: AVX Interconnect / Elco; Part Number: TACK106M002PTA
U3 = CMP-09093-000114-1: IC DRIVER 1/0 8SOIC; Supply Current: 7mA; Number of Receivers: 1; Min Supply Voltage: 3V; Max Supply Current: 10mA; Max Supply Voltage: 3.6V; Turn-On Delay Time: 1.5ns; Data Rate: 600Mbps; Operating Supply Voltage: 3.3V; Length: 5mm; Series: -; Number of Pins: 8; REACH SVHC: No SVHC; Mount: Surface Mount; RoHS Compliant: Yes; Packaging: Rail/Tube; Nominal Supply Current: 7mA; Radiation Hardening: No; Number of Drivers: 1; Width: 4mm; Number of Elements: 1; Lead Free: Contains Lead; Operating Supply Current: 7mA; Min Operating Temperature: -40°C; Propagation Delay: 1.5ns; Package Quantity: 98; Height: 1.5mm; Case/Package: SOIC; Max Operating Temperature: 85°C

## Sheet LMR514205V.SchDoc
size A; SheetNumber: 7; SheetTotal: 8
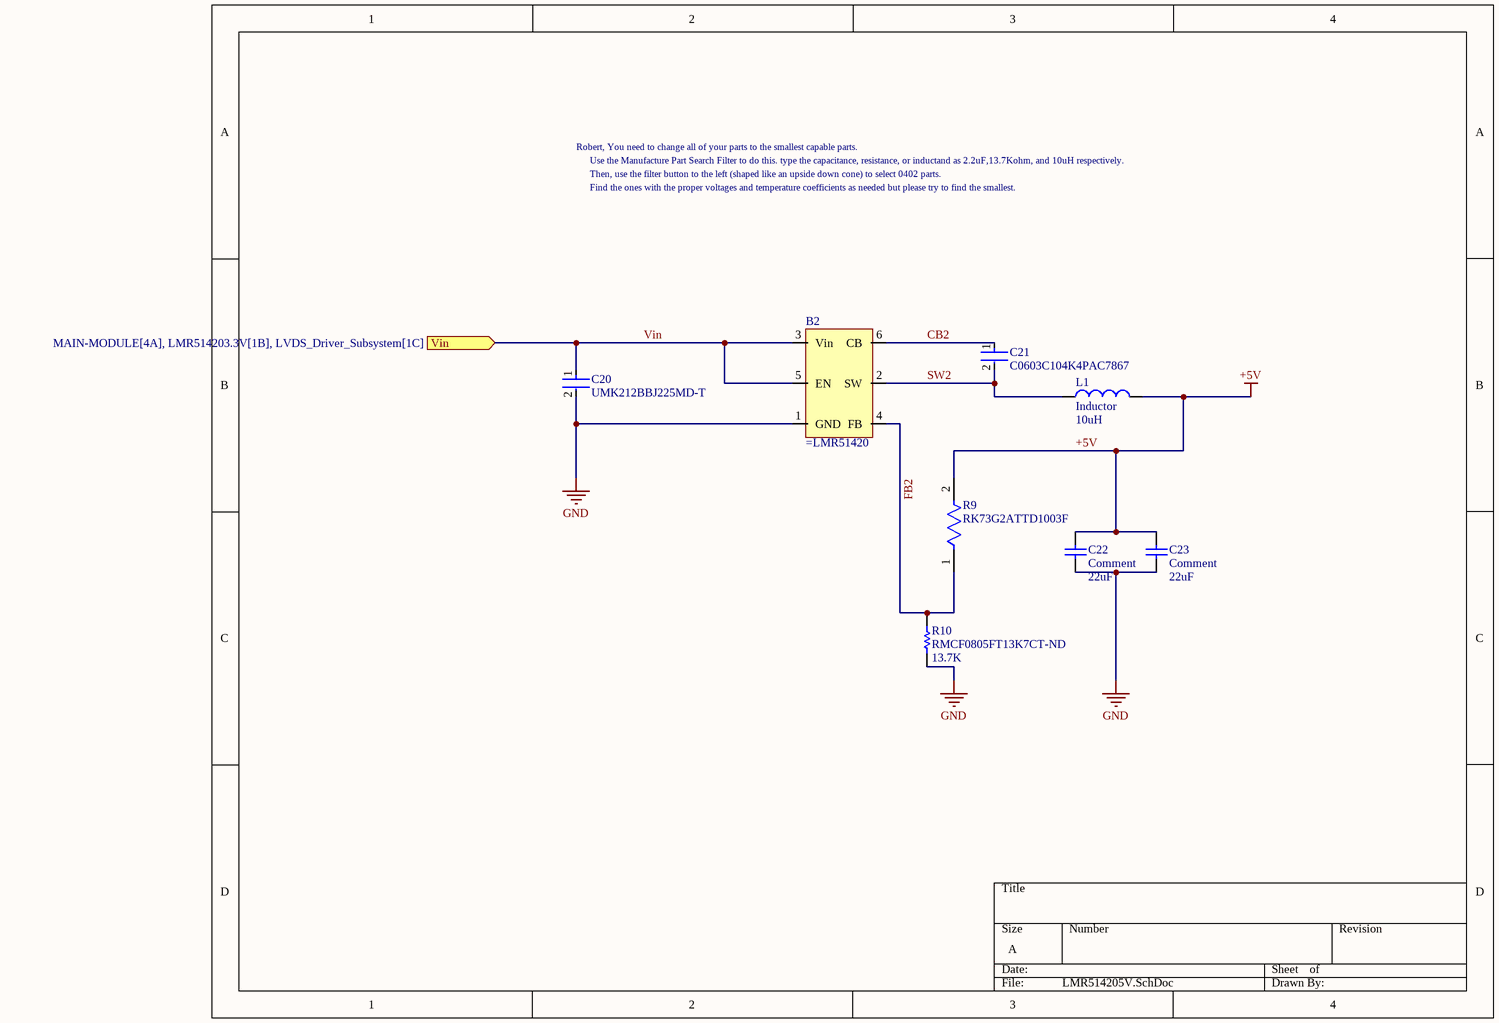
[diagram p6: LMR514205V.SchDoc]

### Parts
B2  (no value)  [LMR51420IC]
C20  UMK212BBJ225MD-T  [FP-0805-L_2_0_0_2-W_1_25-IPC_A]
C21  C0603C104K4PAC7867  [CAP CER 0.1UF 16V X7R 0603]
C22  Comment  value 22uF  [Cap22uF_C1206C226M4PAC7800]
C23  Comment  value 22uF  [Cap22uF_C1206C226M4PAC7800]
L1  Inductor  value 10uH  [MSS1246H-103MED 10uH]
R9  RK73G2ATTD1003F  [FP-RK73G2A-IPC_A]
R10  RMCF0805FT13K7CT-ND  value 13.7K  [RMCF0805FT13K7_13.7k]

### Ports
Vin (in, see MAIN-MODULE[4A], LMR514203.3V[1B], LVDS_Driver_Subsystem[1C])

### Nets
+5V: C22.2 C23.2 L1.2 R9.2
GND: B2.1(GND) C20.2 C22.1 C23.1 R10.1
CB2: B2.6(CB) C21.1
FB2: B2.4(FB) R9.1 R10.2
SW2: B2.2(SW) C21.2 L1.1
Vin: B2.3(Vin) B2.5(EN) C20.1 ; port Vin

### Notes on the sheet
- Robert, You need to change all of your parts to the smallest capable parts.
- Use the Manufacture Part Search Filter to do this. type the capacitance, resistance, or inductand as 2.2uF,13.7Kohm, and 10uH respectively.
- Then, use the filter button to the left (shaped like an upside down cone) to select 0402 parts.
- Find the ones with the proper voltages and temperature coefficients as needed but please try to find the smallest.

### Library data of the parts
B2 = Component_1
C20 = CMP-14477-004278-2: as C24 on sheet LMR514203.3V; Max Operating Temperature: 85°C; Tolerance: 20%; Case Code (Imperial): 0805; Case/Package: 0805; Case Code (Metric): 2012; Capacitance: 2.2uF; Min Operating Temperature: -55°C; Mount: Surface Mount; Voltage Rating: 50V; Packaging: Tape and Reel; RoHS Compliant: Yes
C21 = b4654b650e69147ec39a6b967a45e02: as C25 on sheet LMR514203.3V; Manufacturer Part Number: C0603C104K4PAC7867; Automotive: Yes; Octopart: https://octopart.com/c0603c104k4pactu-kemet-12592163; Device Class L2: Capacitors; ComponentLink2URL: https://api.kemet.com/component-edge/download/datasheet/C0603C100J5GACAUTO.pdf; RoHS: TRUE; Height: 0.87mm; Temperature Characteristic: X5R; Voltage Rating: 16 V; Device Class L1: Passive Components; Category: Cap; Digikey Description: CAP CER 0.1UF 16V X5R 0603; Temperature Range High: +125°C; Package: C0603C-CF; Device Class L3: Ceramic Capacitors; Lead Free: Yes; Temperature: -55°C to +125°C; Temperature Range Low: -55°C; Capacitance: 0.10 μF; ComponentLink2Description: Datasheet
C22 C23 = Cap: Capacitor; Published: 8-Jun-2000; LatestRevisionDate: 17-Jul-2002; LatestRevisionNote: Re-released for DXP Platform.; PackageReference: RAD-0.3; Publisher: Altium Limited; PackageDescription: Radial Cap, Thru-Hole; 2 Leads; 0.3 in Pin Spacing
L1 = Inductor: Code_IEC: 1005; Published: 8-Jun-2000; LatestRevisionDate: 29-May-2009; LatestRevisionNote: IPC-7351 Footprint Added.; PackageReference: 0402-A; Publisher: Altium Limited; PackageDescription: Chip Inductor; Code_JEITA: 0402
R9 = CMP-04015-080178-1: as R11 on sheet LMR514203.3V; Series: RK73G; Termination: SMD/SMT; Packaging: Tape and Reel; Tolerance: 1%; Case Code (Imperial): 0805; RoHS Compliant: Yes; Max Operating Temperature: 125°C; Min Operating Temperature: -55°C; Case Code (Metric): 2012
R10 = Res1: Resistor; Published: 8-Jun-2000; LatestRevisionDate: 17-Jul-2002; LatestRevisionNote: Re-released for DXP Platform.; PackageReference: AXIAL-0.3; Publisher: Altium Limited; PackageDescription: Axial Device, Thru-Hole; 2 Leads; 0.3 in Pin Spacing

## Sheet TPS6513x.SchDoc
size A; SheetNumber: 8; SheetTotal: 8
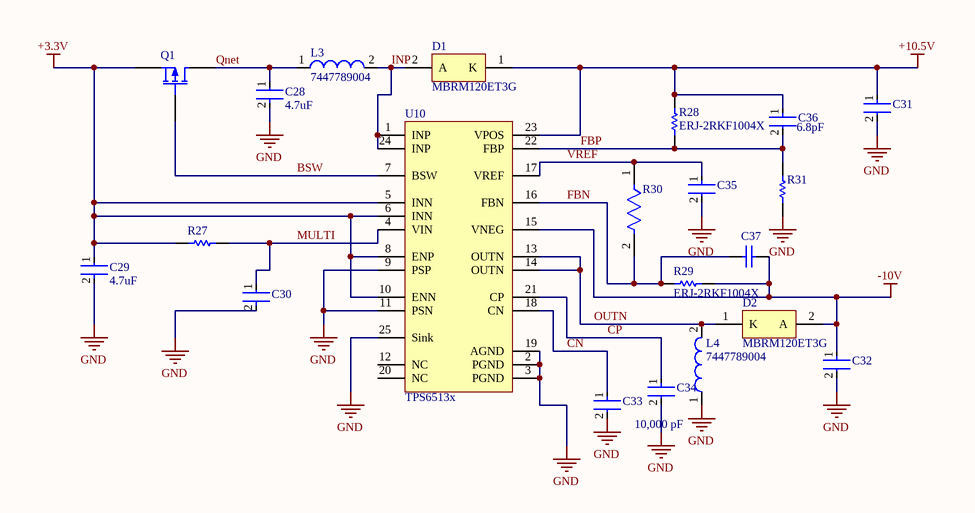
[diagram p7: TPS6513x.SchDoc]

### Parts
C28  4.7uF  [FP-GRM15-MFG]
C29  4.7uF  [FP-GRM15-MFG]
C30  GRM155R71C104KA88D  [FP-GRM15-MFG]  (value not drawn)
C31  CL05A226MQ5QUNC  [FP-CL746-IPC_C]  (value not drawn)
C32  CL05A226MQ5QUNC  [FP-CL746-IPC_C]  (value not drawn)
C33  GRM155R71H472KA01D  [FP-GRM155-0_05-IPC_B]  (value not drawn)
C34  value 10,000 pF  [Yemet_0603]  (hidden comment: C0402C103J4RAC)
C35  GRM155R71C224KA12D  [FP-GRM155-0_05-IPC_C]  (value not drawn)
C36  Capacitance: 6.8pF  [885012007027]  (hidden comment: CGA1A2C0G1E6R8D030BA)
C37  GRM1555C1H7R5CA01D  [CAPC1005X55X25LL05T10]  (value not drawn)
D1  MBRM120ET3G  [ONSC-POWERMITE-2-457-04_D_V]
D2  MBRM120ET3G  [ONSC-POWERMITE-2-457-04_D_V]
L3  7447789004  [WE-PD-S-PB]
L4  7447789004  [WE-PD-S-PB]
Q1  Comment  [PCBComponent_1]  (value not drawn)
R27  ERJ-2RKF1000X  [RESC1005X40X25LL05T05]  (value not drawn)
R28  ERJ-2RKF1004X  [RESC1005X40X25LL05T05]
R29  ERJ-2RKF1004X  [RESC1005X40X25LL05T05]
R30  CRCW0402121KFKED  [FP-CRCW0402-e3-MFG]  (value not drawn)
R31  ERJ-2RKF1303X  [RESC1005X40X25NL05T05]  (value not drawn)
U10  TPS6513x  [TPS6513final]

### Nets
+3.3V: C29.1 Q1.3(S) R27.1 U10.5(INN) U10.6(INN) U10.8(ENP) U10.10(ENN)
+10.5V: C31.1 C36.1 D1.1(K) R28.2 U10.23(VPOS)
-10V: C32.1 C37.2 D2.2(A) R29.1 U10.15(VNEG)
GND: C28.2 C29.2 C30.2 C31.2 C32.2 C33.2 C34.2 C35.2 L4.1 R31.1 U10.2(PGND) U10.3(PGND) U10.9(PSP) U10.11(PSN) U10.19(AGND) U10.25(Sink)
BSW: Q1.2(G) U10.7(BSW)
CN: C33.1 U10.18(CN)
CP: C34.1 U10.21(CP)
FBN: C37.1 R29.2 R30.2 U10.16(FBN)
FBP: C36.2 R28.1 R31.2 U10.22(FBP)
INP: D1.2(A) L3.2 U10.1(INP) U10.24(INP)
MULTI: C30.1 R27.2 U10.4(VIN)
OUTN: D2.1(K) L4.2 U10.13(OUTN) U10.14(OUTN)
Qnet: C28.1 L3.1 Q1.1(D)
VREF: C35.1 R30.1 U10.17(VREF)

Not connected (* = marked no-connect by the designer): U10 12(NC) 20(NC)

### Library data of the parts
C28 C29 = CMP-2100-03641-2: CAP CER 0.1UF 16V X7R 0402; Manufacturer Part Number: GRM155R71C104KA88D; Manufacturer: Murata; Standoff Height: 0mm; Tolerance: 10%; Voltage Rating: 16Vdc; Material: Ceramic; Capacitance: 0.10μF; Value: 0.10μF; RoHS: TRUE; Temperature Characteristic: X7R; Octopart: https://octopart.com/grm155r71c104ka88d-murata-196880; Digikey Description: CAP CER 0.1UF 16V X7R 0402; Device Class L3: Ceramic Capacitors; Height: 0.55mm; ComponentLink2Description: Datasheet; Temperature Range Low: -55°C; Ipc Land Pattern Name: CAPC10050X219; ComponentLink2URL: https://search.murata.co.jp/Ceramy/image/img/A01X/G101/ENG/GRM155R71H471KA01-01A.pdf; Device Class L1: Passive Components; Lead Free: yes; Category: Cap; Package: GRM15; Temperature: -55°C to +125°C; Device Class L2: Capacitors; Temperature Range High: +125°C; Mouser Description: 0402 0.1 uF 16V ±10 % Tolerance X7R SMT Multilayer Ceramic Capacitor
C30 = CMP-2100-03641-2: CAP CER 0.1UF 16V X7R 0402; Manufacturer: Murata; Standoff Height: 0mm; Tolerance: 10%; Voltage Rating: 16Vdc; Material: Ceramic; Capacitance: 0.10μF; Value: 0.10μF; RoHS: TRUE; Manufacturer Part Number: GRM155R71C104KA88D; Temperature Characteristic: X7R; Octopart: https://octopart.com/grm155r71c104ka88d-murata-196880; Digikey Description: CAP CER 0.1UF 16V X7R 0402; Device Class L3: Ceramic Capacitors; Height: 0.55mm; ComponentLink2Description: Datasheet; Temperature Range Low: -55°C; Ipc Land Pattern Name: CAPC10050X219; ComponentLink2URL: https://search.murata.co.jp/Ceramy/image/img/A01X/G101/ENG/GRM155R71H471KA01-01A.pdf; Device Class L1: Passive Components; Lead Free: yes; Category: Cap; Package: GRM15; Temperature: -55°C to +125°C; Device Class L2: Capacitors; Temperature Range High: +125°C; Mouser Description: 0402 0.1 uF 16V ±10 % Tolerance X7R SMT Multilayer Ceramic Capacitor
C31 C32 = CMP-13271-000286-1: Cap Ceramic 22uF 6.3V X5R ±20% SMD 0402 +85°C Paper T/R; Case Code (Imperial): 0402; Tolerance: 20%; Width: 0.02inch; Packaging: Tape and Reel; Case/Package: 0402; Min Operating Temperature: -55°C; Max Operating Temperature: 85°C; Voltage Rating: 6.3V; Capacitance: 22uF; Thickness: 0.022inch; Mount: Surface Mount; Length: 0.039inch; Case Code (Metric): 1005
C33 = CMP-2008-04663-5: Chip Multilayer Ceramic Capacitors for General Purpose, 0402, 4700pF, X7R, 15%, 10%, 50V; Capacitance: 4.7nF; Voltage: 50V; Case/Package: 0402; Termination: SMD/SMT; Case Code (Metric): 1005; Height: 0.5mm; Voltage Rating: 50V; Packaging: Tape and Reel; Width: 0.02inch; Voltage Rating (DC): 50V; Max Operating Temperature: 125°C; Min Operating Temperature: -55°C; Case Code (Imperial): 0402; Material: Ceramic; Lead Free: Lead Free; Length: 1mm; Package Quantity: 1; Thickness: 0.022inch; Dielectric: X7R; Radiation Hardening: No; Depth: 0.5mm; Mount: Surface Mount; Tolerance: 10%; REACH SVHC: No SVHC
C34 = b4654b650e69147ec39a6b967a45e02: C0402 10,000 pF X7R 5.00% 16 V; Manufacturer: Kemet; Tolerance: 0.05; Material: Ceramic; Voltage Rating: 16 V; Temperature Coefficient: 15%; Category: Cap; Manufacturer Part Number: C0402C103J4RAC; ComponentLink2URL: https://content.kemet.com/datasheets/KEM_C1002_X7R_SMD.pdf; Octopart: https://octopart.com/c0402c103j4rac-kemet-8293494; Temperature Range High: +125°C; Temperature: -55°C to +125°C; RoHS: TRUE; Device Class L1: Passive Components; Lead Free: Yes; Temperature Range Low: -55°C; Ipc Land Pattern Name: CAPC10050X50; Package: C0402-BB; Mouser Description: Multilayer Ceramic Capacitors MLCC - SMD/SMT 16volts 0.01uF 5% X7R; Temperature Characteristic: X7R; Device Class L3: Ceramic Capacitors; Height: 0.55mm; Device Class L2: Capacitors; ComponentLink2Description: Datasheet; Capacitance: 10,000 pF; Automotive: No
C35 = CMP-1034-02089-3: Chip Multilayer Ceramic Capacitors for General Purpose, 0402, 0.22uF, X7R, 15%, 10%, 16V; Capacitance: 220nF; Depth: 0.5mm; Dielectric: X7R; Min Operating Temperature: -55°C; Package Quantity: 1; Termination: SMD/SMT; Mount: Surface Mount; Radiation Hardening: No; Height: 0.5mm; Case Code (Metric): 1005; Packaging: Tape and Reel; Material: Ceramic; Voltage: 16V; Voltage Rating (DC): 16V; REACH SVHC: No SVHC; Voltage Rating: 16V; Length: 1mm; Tolerance: 10%; Thickness: 0.022inch; Case Code (Imperial): 0402; Max Operating Temperature: 125°C; Width: 0.02inch; Lead Free: Lead Free; Case/Package: 0402
C36 = b4654b650e69147ec39a6b967a45e02: Cap Ceramic 6.8pF 25V C0G 0.5pF Pad SMD 0201 125°C Automotive T/R; Min Operating Temperature: -55°C; Packaging: Tape and Reel; Mount: Surface Mount; Length: 0.6mm; Dielectric: C0G; Depth: 0.3mm; Ratings: AEC-Q200; Case Code (Metric): 0603; Height: 0.3mm; Weight: 6E-06oz; Case Code (Imperial): 0201; Case/Package: 0201; Thickness: 0.013inch; Voltage Rating: 25V; Package Quantity: 1; Voltage Rating (DC): 25V; Composition: Ceramic; Max Operating Temperature: 125°C; Width: 0.012inch; Termination: SMD/SMT
C37 = CMP-1034-00562-2: Manufacturer: Murata; Part Number: GRM1555C1H7R5CA01D
D1 D2 = CMP-1055-00280-1: Schottky Power Rectifier, 2-Pin Powermite, Pb-Free, Tape and Reel; Manufacturer: On Semiconductor; Configuration: Single; IFSM Max (A): 50; Packing: Tape and Reel; ComponentLink1URL: http://www.onsemi.com/; PartNumber: MBRM120ET3G; Mounting Technology: Surface Mount; PackageReference: POWERMITE-2-457-04; DatasheetVersion: Rev. 3; ComponentLink2URL: http://www.onsemi.cn/pub_link/Collateral/MBRM120E-D.PDF; ComponentLink2Description: Datasheet; PackageVersion: Rev. F, 05/2013; ComponentLink3URL: http://www.onsemi.com/pub_link/Collateral/457-04.PDF; RoHS: TRUE; PackageDescription: 2-Pin POWERMITE, Body 1.965 x 1.9 mm; ComponentLink3Description: Package Specification; ComponentLink1Description: Manufacturer URL
L3 L4 = CMP-1396-00050-1: SMD-Shielded Power Inductor WE-PD, L=4.70 µH; Manufacturer: Wuerth Elektronik; Inductance: 4.70 ÂµH; ComponentLink2URL: http://www.we-online.de/katalog/media/pdf/7447789004.pdf; ComponentLink2Description: Datasheet; PackageDescription: SMD Inductor, 2-Leads, Body 7.3 x 7.3 mm; ComponentLink1Description: Manufacturer URL; PackageReference: WE-PD-S-PB; ComponentLink1URL: http://www.we-online.com; PartNumber: 7447789004
Q1 = MOSFET-P: P-Channel MOSFET; Published: 8-Jun-2000; LatestRevisionDate: 17-Jul-2002; LatestRevisionNote: Re-released for DXP Platform.; PackageVersion: 1995/1996; PackageReference: E3; Publisher: Altium Limited; PackageDescription: TO, Flat Index; 3 In-Line, Axial Leads; Body Dia. 4.6mm; Lead Dia. 0.5 mm (max)
R27 = CMP-2002-00605-3: Chip Resistor, 100 Ohm, +/- 1%, 100 mW, -55 to 155 degC, 0402 (1005 Metric), RoHS, Tape and Reel; Manufacturer: Basic Passives; Power Rating: 100 mW; Resistance: 100 Ohm; Voltage Rating: 50 V; Case\/Package: 0402; Width: 0.5 mm; Pins: 2; ComponentLink2Description: Datasheet; PackageReference: 0402; Height: 0.35 mm; Tolerance: 1%; DatasheetVersion: 04/2015; Case Code (Imperial): 0402; Min Operating Temperature: -55 degC; Radiation Hardening: No; Length: 1 mm; Package Quantity: 10000; PackageDescription: 2-Pin Surface Mount Device, Body 1 x 0.5 mm; Mounting Technology: Surface Mount; Case Code (Metric): 1005; Packaging: Tape and Reel; ComponentLink1URL: http://www.panasonic.com/; RoHSCompliant: true; Max Operating Temperature: 155 degC; REACH SVHC: Yes; PartNumber: ERJ-2RKF1000X; ComponentLink1Description: Manufacturer URL; ComponentLink2URL: http://industrial.panasonic.com/cdbs/www-data/pdf/RDA0000/AOA0000C86.pdf; Mount: Surface Mount
R28 R29 = CMP-2002-00609-3: Chip Resistor, 1 MOhm, +/- 1%, 100 mW, -55 to 155 degC, 0402 (1005 Metric), RoHS, Tape and Reel; Manufacturer: Basic Passives; Voltage Rating: 50 V; Case\/Package: 0402; Resistance: 1 MOhm; Power Rating: 100 mW; Pins: 2; Max Operating Temperature: 155 degC; ComponentLink2URL: http://industrial.panasonic.com/cdbs/www-data/pdf/RDA0000/AOA0000C86.pdf; Weight: 2.8E-05oz; ComponentLink1URL: http://www.panasonic.com/; Radiation Hardening: No; Height: 0.35 mm; Case Code (Imperial): 0402; ComponentLink2Description: Datasheet; Mount: Surface Mount; ComponentLink1Description: Manufacturer URL; REACH SVHC: Yes; PartNumber: ERJ-2RKF1004X; Length: 1 mm; Min Operating Temperature: -55 degC; Width: 0.5 mm; Package Quantity: 10000; Tolerance: 1%; PackageDescription: 2-Pin Surface Mount Device, Body 1 x 0.5 mm; RoHSCompliant: true; DatasheetVersion: 04/2015; PackageReference: 0402; Mounting Technology: Surface Mount; Case Code (Metric): 1005; Packaging: Tape and Reel
R30 = CMP-2002-08171-2: RES Thick Film, 121kΩ, 1%, 0.063W, 100ppm/°C, 0402; Voltage Rating (DC): 50V; Max Power Dissipation: 63mW; Resistance: 121kR; Military Standard: Not; Weight: 2.3E-05oz; Termination: SMD/SMT; Case Code (Metric): 1005; Width: 0.5mm; Tolerance: 1%; Contact Plating: Tin; Temperature Coefficient: 100ppm/°C; Depth: 0.5mm; Length: 1mm; Package Quantity: 10; Radiation Hardening: No; Packaging: Tape and Reel; Power Rating: 63mW; Features: Automotive AEC-Q200; Lead Free: Lead Free; Composition: Thick Film; Min Operating Temperature: -55°C; Height: 0.35mm; Voltage Rating: 50V; Case/Package: 0402; Number of Terminations: 2; Max Operating Temperature: 155°C; Case Code (Imperial): 0402
R31 = CMP-1011-00748-2: Manufacturer: Panasonic; Part Number: ERJ-2RKF1303X
U10 = TI-TPS65130RGE24-2450X2450TP: Boost Inverting Buck-Boost Voltage Converter with 2.7 to 5.5 V Input and -15 to 15 V Output, -40 to 85 degC, 24-Pin VQFN (RGE), Green (RoHS & no Sb/Br); PartNumber: TPS65130RGER; Manufacturer: Texas Instruments; Vout2(V): -15 to -2; Regulated Outputs(#): 2; Switching Frequency(Typ)(kHz): 1400; Vout(Max)(V): 15; Vin(Min)(V): 2.7; SubFamily: Step-Up Regulator; Vin(Max)(V): 5.5; Topology: Boost, Inverting Buck-Boost; ComponentLink2URL: http://www.ti.com/litv/pdf/mpqf124f; ComponentLink2Description: Package Specification; DatasheetVersion: SLVS493B; ComponentLink1Description: Datasheet; Code_JEDEC: MO-220; PackageVersion: revG, Jul-2011; ComponentLink1URL: http://www.ti.com/general/docs/lit/getliterature.tsp?genericPartNumber=TPS65130&fileType=pdf; Eco-Plan: Green (RoHS & no Sb/Br); PackageDescription: 24-Pin Plastic Quad Flatpack No-Lead, 4 x 4 mm Body, 0.5 mm Pitch; PackageReference: RGE0024B; Vout(Min)(V): -15; Mounting Technology: Surface Mount

## Nets that join several sheets
+3.3V: PIC32_Subsystem (12 pins), ADC_Subsystem (C13.1 U2.25), ICD4_Interface_Module (J4.2), LMR514203.3V (C26.2 C27.2 L2.2 R11.1), LVDS_Driver_Subsystem (C18.1 C19.2 U3.1), TPS6513x (7 pins)
+5V: MAIN-MODULE (5 pins), ADC_Subsystem (C11.1 U2.29), LMR514205V (C22.2 C23.2 L1.2 R9.2)
+10.5V: MAIN-MODULE (J2.14), TPS6513x (5 pins)
-10V: MAIN-MODULE (J2.18), TPS6513x (5 pins)
GND: MAIN-MODULE (11 pins), PIC32_Subsystem (16 pins), ADC_Subsystem (14 pins), ICD4_Interface_Module (J4.3), LMR514203.3V (5 pins), LVDS_Driver_Subsystem (12 pins), LMR514205V (5 pins), TPS6513x (16 pins)
A_GP0: MAIN-MODULE (J1.21), PIC32_Subsystem (U1.4)
A_GP1: MAIN-MODULE (J1.20), PIC32_Subsystem (U1.5)
A_GP2: MAIN-MODULE (J1.19), PIC32_Subsystem (U1.6)
A_SHDN: MAIN-MODULE (J1.11), PIC32_Subsystem (U1.3)
ADC_CH0_CH1_N: MAIN-MODULE (J2.13), ADC_Subsystem (U2.31)
ADC_CH0_CH1_P: MAIN-MODULE (J2.12), ADC_Subsystem (U2.32)
ADC_CH2_CH3_N: MAIN-MODULE (J2.1), ADC_Subsystem (U2.1)
ADC_CH2_CH3_P: MAIN-MODULE (J2.2), ADC_Subsystem (U2.2)
ADC_CH4_CH5_N: MAIN-MODULE (J1.13), ADC_Subsystem (U2.7)
ADC_CH4_CH5_P: MAIN-MODULE (J1.12), ADC_Subsystem (U2.8)
ADC_CH6_CH7_N: MAIN-MODULE (J1.1), ADC_Subsystem (U2.9)
ADC_CH6_CH7_P: MAIN-MODULE (J1.2), ADC_Subsystem (U2.10)
B_GP0: MAIN-MODULE (J1.7), PIC32_Subsystem (U1.63)
B_GP1: MAIN-MODULE (J1.8), PIC32_Subsystem (U1.64)
B_GP2: MAIN-MODULE (J1.9), PIC32_Subsystem (U1.1)
B_SHDN: MAIN-MODULE (J1.10), PIC32_Subsystem (U1.2)
BUSY: PIC32_Subsystem (U1.60), ADC_Subsystem (U2.19)
C_GP0: MAIN-MODULE (J2.21), PIC32_Subsystem (U1.53)
C_GP1: MAIN-MODULE (J2.20), PIC32_Subsystem (U1.54)
C_GP2: MAIN-MODULE (J2.19), PIC32_Subsystem (U1.55)
C_SHDN: MAIN-MODULE (J2.11), PIC32_Subsystem (U1.46)
CNV: PIC32_Subsystem (U1.62), ADC_Subsystem (U2.16)
D_GP0: MAIN-MODULE (J2.7), PIC32_Subsystem (U1.42)
D_GP1: MAIN-MODULE (J2.8), PIC32_Subsystem (U1.43)
D_GP2: MAIN-MODULE (J2.9), PIC32_Subsystem (U1.44)
D_SHDN: MAIN-MODULE (J2.10), PIC32_Subsystem (U1.45)
MCLR: PIC32_Subsystem (MCLR.2 R3.1 U1.7), ICD4_Interface_Module (J4.1)
NetU1_47: PIC32_Subsystem (U1.47), ADC_Subsystem (U2.22)
NetU1_50: PIC32_Subsystem (U1.50), ADC_Subsystem (U2.21)
NetU1_51: PIC32_Subsystem (U1.51), ADC_Subsystem (U2.20)
PGC: PIC32_Subsystem (U1.17), ICD4_Interface_Module (J4.5)
PGD: PIC32_Subsystem (U1.18), ICD4_Interface_Module (J4.4)
RDL: PIC32_Subsystem (U1.61), ADC_Subsystem (U2.18)
RESET: PIC32_Subsystem (U1.48), ADC_Subsystem (U2.24)
UART_TX: PIC32_Subsystem (U1.32), LVDS_Driver_Subsystem (U3.2)
Vin: LMR514203.3V (B1.3 B1.5 C24.1), LVDS_Driver_Subsystem (J3.5 J3.6 J3.7), LMR514205V (B2.3 B2.5 C20.1)